# EAGLE design OPR_Main_v2 (EAGLE 7.6.0)
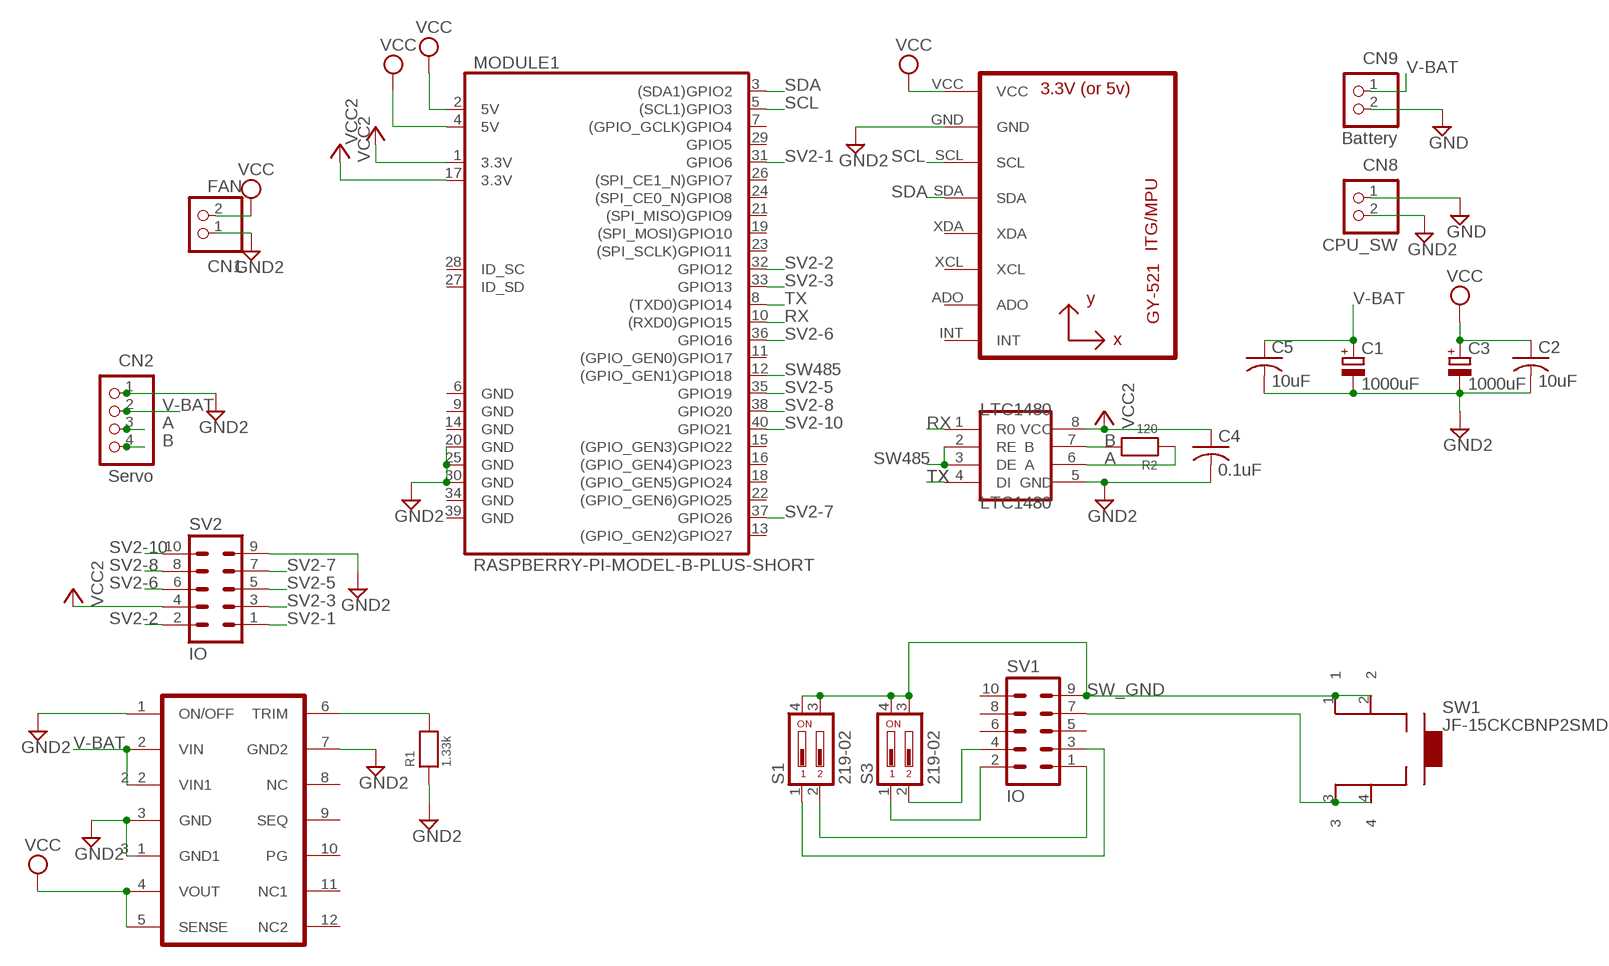
[diagram p0: schematic, sheet 1]

## Parts
C1  1000uF  CPOL-EUE5-10.5  [E5-10,5]
C2  10uF  C-USC3225  [C3225]
C3  1000uF  CPOL-EUE5-10.5  [E5-10,5]
C4  0.1uF  C-USC2012  [C2012]
C5  10uF  C-USC3225  [C3225]
CN1  FAN  B2B-XH-A  [B2B-XH-A]
CN2  Servo  S4B-XH-A  [S4B-XH-A]
CN8  CPU_SW  B2P-VH  [B2P-VH]
CN9  Battery  B2P-VH  [B2P-VH]
LTC1480  LTC1480  [SOIC-8]
MODULE1  RASPBERRY-PI-MODEL-B-PLUS-SHORT  [RASPBERRY-PI-MODEL-B-PLUS-SHORT]
R1  1.33k  RESISTOR0805_NOTHERMALS  [0805_NOTHERMALS]
R2  120  RESISTOR0805_NOTHERMALS  [0805_NOTHERMALS]
S1  219-02  [CTS-219-02]
S3  219-02  [CTS-219-02]
SV1  IO  ML10  [ML10]
SV2  IO  ML10  [ML10]
SW1  JF-15CKCBNP2SMD  [JF-15CKCBNP2-SMD]
U1  GY-521MPU6050  [GY-521]
U$3  OKL-T/W-12N-C  OKL_T6_W12  [OKL_T6_W12]

## Nets
A: CN2.3 LTC1480.6(A) R2.1
B: CN2.4 LTC1480.7(B) R2.2
GND [Supply]: CN8.1 CN9.2
GND2 [Supply]: C1.- C2.2 C3.- C4.2 C5.2 CN1.1 CN2.1 CN8.2 LTC1480.5(GND) MODULE1.20(GND) MODULE1.25(GND) MODULE1.30(GND) R1.1 SV2.9 U1.GND U$3.1(ON/OFF) U$3.3(GND) U$3.3_1(GND1) U$3.7(GND2)
N$1: R1.2 U$3.6(TRIM)
N$3: S3.2 SV1.4
N$5: SV1.7 SW1.3 SW1.4
N$6: S3.1 SV1.2
N$7: S1.2 SV1.1
N$8: S1.1 SV1.3
RX: LTC1480.1(R0) MODULE1.10((RXD0)GPIO15)
SCL [i2c]: MODULE1.5((SCL1)GPIO3) U1.SCL
SDA [i2c]: MODULE1.3((SDA1)GPIO2) U1.SDA
SV2-1: MODULE1.31(GPIO6) SV2.1
SV2-2: MODULE1.32(GPIO12) SV2.2
SV2-3: MODULE1.33(GPIO13) SV2.3
SV2-5: MODULE1.35(GPIO19) SV2.5
SV2-6: MODULE1.36(GPIO16) SV2.6
SV2-7: MODULE1.37(GPIO26) SV2.7
SV2-8: MODULE1.38(GPIO20) SV2.8
SV2-10: MODULE1.40(GPIO21) SV2.10
SW485: LTC1480.2(RE) LTC1480.3(DE) MODULE1.12((GPIO_GEN1)GPIO18)
SW_GND [Supply]: S1.3 S1.4 S3.3 S3.4 SV1.9 SW1.1 SW1.2
TX: LTC1480.4(DI) MODULE1.8((TXD0)GPIO14)
V-BAT [Supply]: C1.+ C5.1 CN2.2 CN9.1 U$3.2(VIN) U$3.2_2(VIN1)
VCC [Supply]: C2.1 C3.+ CN1.2 MODULE1.2(5V) MODULE1.4(5V) U1.VCC U$3.4(VOUT) U$3.5(SENSE)
VCC2 [Supply]: C4.1 LTC1480.8(VCC) MODULE1.1(3.3V) MODULE1.17(3.3V) SV2.4
Unconnected: MODULE1.6(GND) MODULE1.7((GPIO_GCLK)GPIO4) MODULE1.9(GND) MODULE1.11((GPIO_GEN0)GPIO17) MODULE1.13((GPIO_GEN2)GPIO27) MODULE1.14(GND) MODULE1.15((GPIO_GEN3)GPIO22) MODULE1.16((GPIO_GEN4)GPIO23) MODULE1.18((GPIO_GEN5)GPIO24) MODULE1.19((SPI_MOSI)GPIO10) MODULE1.21((SPI_MISO)GPIO9) MODULE1.22((GPIO_GEN6)GPIO25) MODULE1.23((SPI_SCLK)GPIO11) MODULE1.24((SPI_CE0_N)GPIO8) MODULE1.26((SPI_CE1_N)GPIO7) MODULE1.27(ID_SD) MODULE1.28(ID_SC) MODULE1.29(GPIO5) MODULE1.34(GND) MODULE1.39(GND) SV1.5 SV1.6 SV1.8 SV1.10 U1.ADO U1.INT U1.XCL U1.XDA U$3.8(NC) U$3.9(SEQ) U$3.10(PG) U$3.11(NC1) U$3.12(NC2)

## Library data of the parts
C1 C3 = resistor:CPOL-EU: POLARIZED CAPACITOR, European symbol
C2 C5 = adafruit:C-US: CAPACITOR, American symbol
C4 = rcl:C-US: CAPACITOR, American symbol
CN1 = jst-xh:B2B-XH-A: Wire-to-Board 2.5mm pitch top mount connector Source: http://www.jst-mfg.com/product/pdf/jpn/XH.pdf http://www.jst-mfg.com/product/detail.php?series=277
CN2 = jst-xh:S4B-XH-A: Wire-to-Board 2.5mm pitch side mount connector Source: http://www.jst-mfg.com/product/pdf/jpn/XH.pdf http://www.jst-mfg.com/product/detail.php?series=277
CN8 CN9 = jst-vh:B2P-VH: Wire-to-Board 3.96mm pitch top mount connector Source: http://www.jst-mfg.com/product/pdf/jpn/VH.pdf http://www.jst-mfg.com/product/detail.php?series=262
LTC1480 = Mylib:LTC1480
MODULE1 = raspberry-pi:RASPBERRY-PI-MODEL-B-PLUS: Raspberry Pi Model B Plus
R1 R2 = microbuilder:RESISTOR: Resistors 0402 - 0402 Surface Mount Package 22 Ohm 1% 1/16W [Digikey: 311-22.0LRTR-ND] 33 Ohm 5% 1/16W 1.0K 5% 1/16W 1.5K 5% 1/16W 2.0K 1% 1/16W 10.0K 1% 1/16W [Digikey: 311-10.0KLRTR-ND] 10.0K 5% 1/16W [Digikey: RMCF0402JT10K0TR-ND] 12.1K 1% 1/16W [Digikey: 311-22.0LRTR-ND] 100.0K 5% 1/16W 0603 - 0603 Surface Mount Package 0 Ohm 1/10 Watt 1% Resistor 15 Ohm 1/10 Watt 1% Resistor 33 Ohm 1/10 Watt 1% Resistor 49.9 Ohm 1/10 Watt 1% Resistor 100 Ohm 1/10 Watt 1% Resistor 150 Ohm 1/10 Watt 1% Resistor 240 Ohm 1/10 Watt 1% Resistor 390 Ohm 1/10 Watt 1% Resistor 560 Ohm 1/10 Watt 1% Resistor 680 Ohm 1/10 Watt 1% Resistor 750 Ohm 1/10 Watt 1% Resistor 1.0K Ohm 1/10 Watt 1% Resistor 1.5K Ohm 1/10 Watt 1% Resistor 2.0K Ohm 1/10 Watt 1% Resistor 2.2K Ohm 1/10 Watt 1% Resistor 3.3K Ohm 1/10 Watt 1% Resistor 4.7K Ohm 1/10 Watt 1% Resistor 10.0K Ohm 1/10 Watt 1% Resistor 12.0K Ohm 1/10 Watt 1% Resistor 12.1K Ohm 1/10 Watt 1% Resistor 20.0K Ohm 1/10 Watt 1% Resistor 33.0K Ohm 1/10 Watt 1% Resistor 100.0K Ohm 1/10 Watt 1% Resistor 0805 - 0805 Surface Mount Package 0 Ohm 1/8 Watt 1% Resistor 33 Ohm 1/8 Watt 1% Resistor 100 Ohm 1/8 Watt 1% Resistor 150 Ohm 1/8 Watt 1% Resistor 200 Ohm 1/8 Watt 1% Resistor 240 Ohm 1/8 Watt 1% Resistor 330 Ohm 1/8 Watt 1% Resistor 390 Ohm 1/8 Watt 1% Resistor 470 Ohm 1/8 Watt 1% Resistor 1.0K Ohm 1/8 Watt 1% Resistor 1.5K Ohm 1/8 Watt 1% Resistor 2.0K Ohm 1/8 Watt 1% Resistor 4.7K Ohm 1/8 Watt 1% Resistor 5.1K Ohm 1/8 Watt 1% Resistor 5.6K Ohm 1/8 Watt 1% Resistor 10.0K Ohm 1/8 Watt 1% Resistor 22.0K Ohm 1/8 Watt 1% Resistor 33.0K Ohm 1/8 Watt 1% Resistor 100K Ohm 1/8 Watt 1% Resistor 1206 - 1206 Surface Mount Package 2012 - 2010 Surface Mount Package 0.11 Ohm 1/2 Watt 1% Resistor - Digikey: RHM.11UCT-ND
S1 S3 = switch-dil:219-02*: Surface Mount DIP Switch Series 219 SMT CTS Electronic Components Sourc: www.ctscorp.com; OC_FARNELL: unknown; OC_NEWARK: unknown
SV1 SV2 = con-ml:ML10: HARTING; OC_FARNELL: unknown; OC_NEWARK: unknown
SW1 = nkk-JF15CKCBNP2:JF-15CKCBNP2: JF-15CKCBNP2
U1 = Mylib:GY-521
U$3 = Mylib:OKL_T6_W12

## Net classes
0 default: width 0.406 mm, clearance 0.127 mm
1 Supply: width 1.524 mm, clearance 0.127 mm
2 i2c: width 0.813 mm, clearance 0.127 mm

## Board
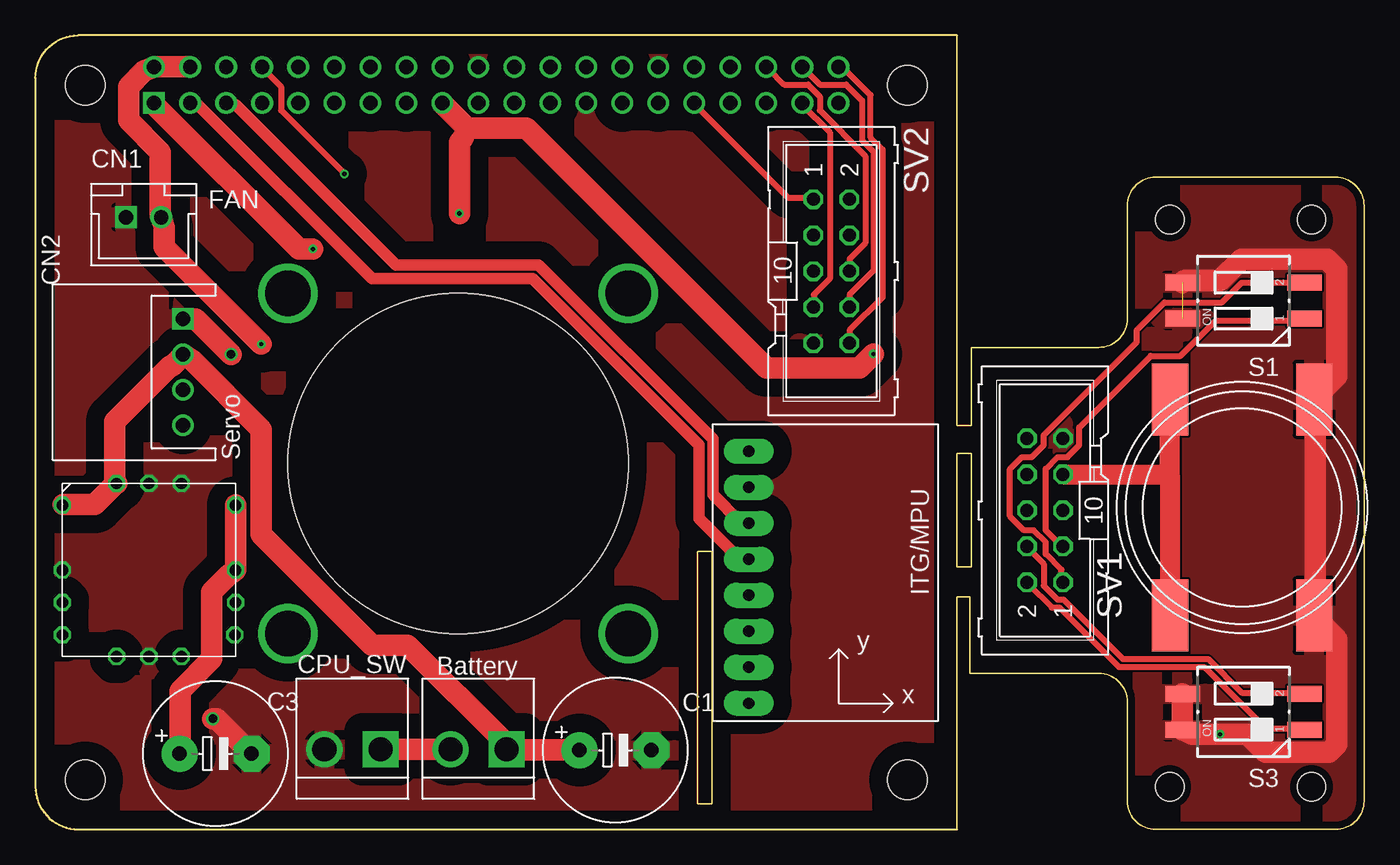
[diagram p1: board, top side]
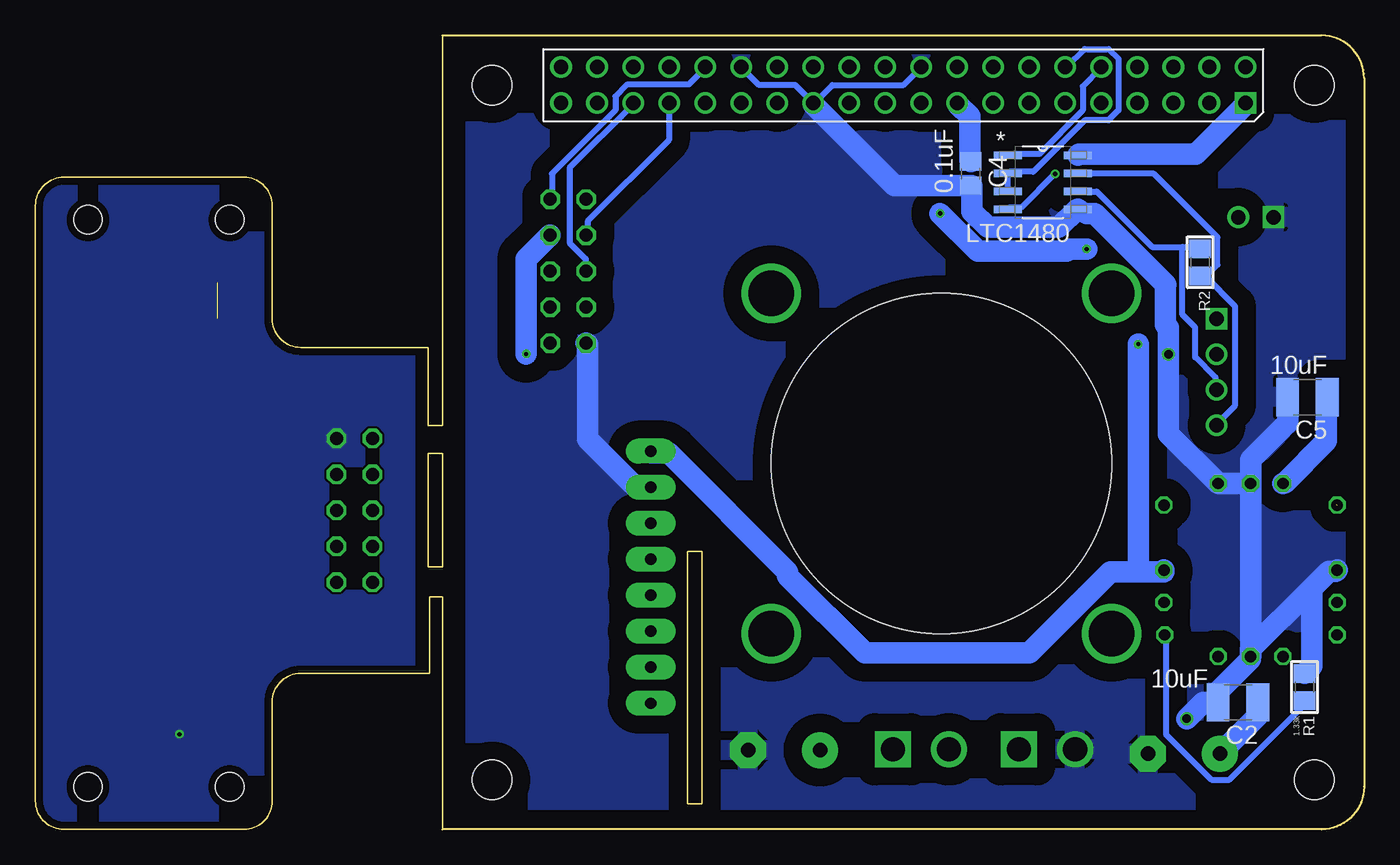
[diagram p2: board, bottom side, seen from below]

Size 93.7 x 56 mm. Coordinates in mm from the lower left corner, seen from the top.
Outline: 65,56 65,28.5 66,28.5 66,34 75,34 arc90 77,36 77,44 arc-90 79,46 91.7,46 arc-90 93.7,44 93.7,2 arc-90 91.7,0 79,0 arc-90 77,2 77,9 arc90 75,11 65.9,11 65.9,16.4 65,16.4 65,0
Outline: 46.7,19.6 47.7,19.6 47.7,1.8 46.7,1.8 46.7,19.6
Outline: 65,18.5 66,18.5 66,26.5 65,26.5 65,18.5
Copper layers (1*16): Top 0.035mm / dielectric 1.53mm / Bottom 0.035mm
Design rules "pban_5mil-l2 *": minimum track width 5mil, minimum drill 0.3mm, track to track 6mil, track to pad 0.229mm, pad to pad 6mil, via to via 6mil, smd to smd 6mil, copper to edge 0.5mm, drill to drill 0.5mm, minimum pad ring 0.15mm, minimum via ring 0.15mm, stop-mask expansion 4mil, vias tented up to drill 0.35mm, thermal gap 10mil
Holes 24 mm at 29.81,25.8
Holes 2 mm at 80,43 80,3 90,43 90,3

### Footprints (pad centres in the part's own frame; a part is rotated, then mirrored left to right if it is on the bottom)
E5-10,5 = drill 1.016 pad 2.54: + -2.54,0 | drill 1.016 pad 2.54 octagon: - 2.54,0
C3225 = smd 1.6 x 2.7: 1 -1.4,0; 2 1.4,0
C2012 = smd 1.3 x 1.5: 1 -0.85,0; 2 0.85,0
B2B-XH-A = drill 1.016 square: 1 -1.25,0 | drill 1.016: 2 1.25,0
S4B-XH-A = drill 1.016 square: 1 3.75,0 | drill 1.016: 2 1.25,0; 3 -1.25,0; 4 -3.75,0
B2P-VH = drill 1.7 square: 1 -1.98,0 | drill 1.7: 2 1.98,0
SOIC-8 = smd 1.981 x 0.533: 1 -2.464,1.905; 2 -2.464,0.635; 3 -2.464,-0.635; 4 -2.464,-1.905; 5 2.464,-1.905; 6 2.464,-0.635; 7 2.464,0.635; 8 2.464,1.905
RASPBERRY-PI-MODEL-B-PLUS-SHORT = drill 1.016 square: 1 8.37,51.23 | drill 1.016: 2 8.37,53.77; 3 10.91,51.23; 4 10.91,53.77; 5 13.45,51.23; 6 13.45,53.77; 7 15.99,51.23; 8 15.99,53.77; 9 18.53,51.23; 10 18.53,53.77; 11 21.07,51.23; 12 21.07,53.77; 13 23.61,51.23; 14 23.61,53.77; 15 26.15,51.23; 16 26.15,53.77; 17 28.69,51.23; 18 28.69,53.77; 19 31.23,51.23; 20 31.23,53.77; 21 33.77,51.23; 22 33.77,53.77; 23 36.31,51.23; 24 36.31,53.77; 25 38.85,51.23; 26 38.85,53.77; 27 41.39,51.23; 28 41.39,53.77; 29 43.93,51.23; 30 43.93,53.77; 31 46.47,51.23; 32 46.47,53.77; 33 49.01,51.23; 34 49.01,53.77; 35 51.55,51.23; 36 51.55,53.77; 37 54.09,51.23; 38 54.09,53.77; 39 56.63,51.23; 40 56.63,53.77 | hole 2.8: 3.5,52.5; 3.5,3.5; 61.5,3.5; 61.5,52.5
0805_NOTHERMALS = smd 1.3 x 1.5: 1 -0.95,0; 2 0.95,0
CTS-219-02 = smd 1.13 x 2.44: 1 -1.27,-4.3; 2 1.27,-4.3; 3 1.27,4.3; 4 -1.27,4.3
ML10 = drill 0.914 octagon: 1 -5.08,-1.27; 2 -5.08,1.27; 3 -2.54,-1.27; 4 -2.54,1.27; 5 0,-1.27; 6 0,1.27; 7 2.54,-1.27; 8 2.54,1.27; 9 5.08,-1.27; 10 5.08,1.27
JF-15CKCBNP2-SMD = smd 2.54 x 5.08: 1 5.08,7.62; 2 5.08,-7.62; 3 -5.08,7.62; 4 -5.08,-7.62
GY-521 = drill 0.8 pad 1.778 long: ADO -8.89,-6.35; GND -8.89,6.35; INT -8.89,-8.89; SCL -8.89,3.81; SDA -8.89,1.27; VCC -8.89,8.89; XCL -8.89,-3.81; XDA -8.89,-1.27
OKL_T6_W12 = drill 0.8 octagon: 1 0,6.1; 2 0,10.68; 2_2 3.81,12.2; 3 6.1,12.2; 3_1 8.39,12.2; 4 12.2,10.68; 5 12.2,6.1; 6 12.16,1.52; 7 6.1,0; 8 3.81,0; 9 0,1.52; 10 0,3.81; 11 12.2,3.81; 12 8.39,0

### Placement (x,y rotation side)
C1  40.9,5.59 0 top
C2  8.89,8.95 180 bottom
C3  12.7,5.33 0 top
C4  27.74,46.25 270 bottom
C5  3.99,30.48 180 bottom
CN1  7.62,43.18 0 top
CN2  10.41,32.26 90 top
CN8  22.36,5.64 180 top
CN9  31.25,5.64 180 top
LTC1480  22.66,45.64 0 bottom
MODULE1  0,0 0 top
R1  4.19,10.03 270 bottom
R2  11.56,40.01 270 bottom
S1  85.2,37.3 90 top
S3  85.2,8.3 90 top
SV1  71.2,22.5 90 top
SV2  56.13,39.37 270 top
SW1  85.1,22.7 0 top
U1  59.2,17.78 0 top
U$3  1.91,12.19 0 top

### Tracks (layer width: path | path; a pad name or v marks a point on that pad's centre or on a via)
A
  Bottom 0.406: 12.8,41.07 14.95,41.07 18.86,44.98 20.12,44.98 LTC1480.6 | 12.8,41.07 11.6,41.07 R2.1 | CN2.3 10.48,31.01 10.48,31.88 11.9,33.3 11.9,35.4 12.8,36.3 12.8,41.07
B
  Bottom 0.406: CN2.4 10.34,28.64 9.08,29.9 9.08,36.88 11.18,38.98 11.46,38.98 R2.2 11.04,39.12 10.34,39.81 10.34,41.77 14.81,46.24 20.12,46.24 LTC1480.7
GND
  Top 1.524: CN8.1 CN9.2
GND2  (via drill 0.6)
  Top 1.524: CN2.1 11.29,36.01 v13.8,33.5 | v12.5,7.8 12.77,7.8 C3.-
  Bottom 0.406: MODULE1.20 32.5,52.5 37.5,52.5 38.77,51.23 MODULE1.25 38.85,51.25 40.1,52.5 42.66,52.5 MODULE1.30
  Bottom 1.524: 20.26,43.73 21.51,42.47 26.54,42.47 27.66,43.59 27.66,45.4 C4.2 28.5,45.4 33.11,45.4 38.84,51.13 MODULE1.25 | 20.26,43.73 LTC1480.5 | SV2.9 54.76,34.23 54.76,27.52 51.41,24.17 50.43,24.17 U1.GND | 20.26,43.73 19.56,43.45 19,43.45 13.97,38.42 14,38.39 14,35.6 13.8,35.4 v13.8,33.5 13.8,27.9 U$3.3_1 U$3.3 | C5.2 5.39,28.71 8,26.1 U$3.3 | U$3.7 8.01,11.99 10.3,9.7 10.3,8.96 C2.2 11.35,8.95 v12.5,7.8 | U$3.3 U$3.7 | R1.1 4.19,11.01 3.7,11.5 3.7,17 | 3.7,17 2.5,18.2 2,18.2 U$3.1 | U$3.7 8.01,12.7 3.7,17
  pour Bottom (isolate 1.27, rank 2): -1.61,56.97 62.68,57.04 62.68,-1.89 -1.61,-2.36
  pour Top (isolate 1.27, rank 2): 62.67,57.08 62.67,-0.02 -0.09,-0.3 -0.23,56.89
N$1
  Bottom 0.406: R1.2 4.19,8.8 9.5,3.49 10.76,3.49 13.97,6.71 13.97,13.69 U$3.6
N$3
  Top 0.406: S3.2 89.41,9.64 85.08,9.64 82.7,12.01 76.69,12.01 72.5,16.2 72.08,16.2 71.11,17.18 71.11,18.72 69.99,19.84 SV1.4
N$5
  Top 0.406: 79.91,30.32 SW1.3 | 79.91,15.09 SW1.4
  Top 1.422: SV1.7 79.96,25.04 80,25 | 80,25 80,30.3 SW1.3 | 80,25 80,15.1 SW1.4
N$6
  Top 0.406: S3.1 89.41,7.12 86.75,7.12 82.42,11.46 76.42,11.46 72.22,15.65 71.67,15.65 69.99,17.32 SV1.2
N$7
  Top 0.406: S1.2 89.41,38.56 85.08,38.56 83.68,37.16 79.63,37.16 77.67,35.2 77.67,34.37 71.11,27.8 71.11,27.1 70.27,26.26 69.57,26.26 68.73,25.43 68.73,22.07 69.71,21.09 70.41,21.09 71.25,20.26 71.25,19.42 72.36,18.3 72.36,17.46 SV1.1
N$8
  Top 0.406: S1.1 89.41,35.9 83.26,35.9 80.75,33.39 78.65,33.39 73.62,28.36 73.62,27.1 72.78,26.26 72.08,26.26 71.25,25.43 71.25,21.09 72.36,19.98 SV1.3
RX
  Bottom 0.406: LTC1480.1 25.01,47.64 22.91,47.64 19.84,50.71 19.84,52.39 18.58,53.65 MODULE1.10
S$6  (via drill 3.2)
  other vias: 17.81,37.81
S$7  (via drill 3.2)
  other vias: 17.81,13.81
S$8  (via drill 3.2)
  other vias: 41.81,13.81
S$9  (via drill 3.2)
  other vias: 41.81,37.81
SCL
  Top 0.813: MODULE1.5 13.55,51.13 14.11,51.13 25.43,39.81 35.48,39.81 47.78,27.52 47.78,23.61 49.73,21.65 50.29,21.65 U1.SCL
SDA
  Top 0.813: MODULE1.3 11.04,51.13 11.46,51.13 23.75,38.84 35.06,38.84 46.8,27.1 46.8,21.93 49.59,19.14 50.29,19.14 U1.SDA
SV2-1
  Top 0.406: SV2.1 54.76,44.56 53.09,44.56 46.52,51.13 MODULE1.31
SV2-2
  Bottom 0.406: SV2.2 57.28,44.56 57.28,46.24 52.81,50.71 52.81,51.69 51.97,52.53 47.64,52.53 46.52,53.65 MODULE1.32
SV2-3
  Bottom 0.406: SV2.3 54.76,41.91 54.76,42.89 49.03,48.62 49.03,51.13 MODULE1.33
SV2-5
  Bottom 0.406: SV2.5 54.9,39.4 54.9,40.23 56.02,41.35 56.02,46.66 51.55,51.13 MODULE1.35
SV2-6
  Top 0.406: SV2.6 57.42,39.4 57.42,40.23 58.53,41.35 58.53,47.5 55.32,50.71 55.32,51.69 54.48,52.53 52.81,52.53 51.69,53.65 MODULE1.36
SV2-7
  Top 0.406: SV2.7 54.9,36.88 54.9,37.72 56.02,38.84 56.02,49.17 54.06,51.13 MODULE1.37
SV2-8
  Top 0.406: SV2.8 57.42,36.88 57.42,37.72 59.1,39.4 59.1,47.8 58.3,48.6 58.3,51.4 57.17,52.53 55.32,52.53 54.2,53.65 MODULE1.38
SV2-10
  Top 0.406: SV2.10 57.42,34.37 57.42,35.2 59.75,37.54 59.75,47.95 58.9,48.8 58.9,51.8 56.93,53.77 MODULE1.40
SW485
  Bottom 0.406: LTC1480.3 25.15,45.12 25.15,46.24 LTC1480.2 25.01,46.38 23.33,46.38 19.7,50.01 18.02,50.01 17.32,50.71 17.32,54.34 18.02,55.04 19.7,55.04 20.95,53.78 MODULE1.12
SW_GND  (via drill 0.3)  (1 unrouted)
  Top 1.524: S3.3 80.89,9.5 80.89,7.12 S3.4 81.58,6.71 v83.54,6.71 85.5,6.71 86.75,5.45 91.22,5.45 91.78,6.01 91.78,13.41 90.25,14.95 SW1.2 90.25,15.79 90.25,29.62 SW1.1 90.25,30.45 91.78,31.99 91.78,39.53 91.08,40.23 85.08,40.23 83.54,38.7 81.03,38.7 S1.3
  pour Bottom: 94,46 94,0 77,0 77,11 67.6,11 67.6,34 77,34 77,46
  pour Top: 67.6,33.9 75.3,34 76.9,35.4 76.9,45.6 76.8,45.7 92.7,45.7 93.7,44.7 93.7,1.3 92.5,0.1 78.6,0.1 77.3,1.4 77.3,9.4 75.7,11 67.6,10.9
TX  (via drill 0.3)
  Top 0.406: v21.79,46.24 17.32,50.71 17.32,52.39 16.07,53.65 MODULE1.8
  Bottom 0.406: v21.79,46.24 24.17,43.87 25.01,43.87 LTC1480.4
V-BAT  (1 unrouted)
  Top 1.524: 1.96,22.91 4.19,22.91 5.59,24.31 | 5.59,24.31 U$3.2_2 | 5.59,24.31 5.59,28.78 9.5,32.69 9.64,32.69 10.34,33.39 CN2.2 11.04,33.11 15.93,28.22 15.93,20.82 23.75,12.99 26.26,12.99 33.23,6.03 33.23,5.44 CN9.1 33.23,5.33 33.5,5.6 C1.+
  Bottom 1.524: C5.1 2.65,30.45 2.65,27.38 5.59,24.45 U$3.2_2
VCC  (via drill 0.3)
  Top 1.524: MODULE1.4 10.9,53.78 8.38,53.78 MODULE1.2 7.68,53.51 6.57,52.39 6.57,50.01 8.8,47.78 8.8,43.31 CN1.2 9.08,42.47 9.08,41.07 v15.93,34.23 | U$3.5 14.11,22.77 U$3.4 | U$3.5 | C3.+ 10.2,5.45 10.2,9.78 12.43,12.01 12.43,16.76 13.55,17.88 U$3.5
  Bottom 1.524: 15.93,18.16 14.11,18.16 U$3.5 | 15.93,18.16 17.88,18.16 23.61,12.43 35.2,12.43 40.65,17.88 40.65,18.16 49.03,26.54 50.29,26.54 U1.VCC | 15.93,18.16 v15.93,34.23 | C2.1 7.49,8 C3.+
VCC2  (via drill 0.3)
  Top 1.524: v59.09,33.53 58.12,32.55 51.55,32.55 34.65,49.45 30.45,49.45 | 30.45,49.45 28.78,51.13 MODULE1.17 | v19.56,40.93 18.58,40.93 8.38,51.13 MODULE1.1 | v29.9,43.45 29.9,48.48 30.18,48.76 30.45,49.45
  Bottom 1.524: LTC1480.8 20.12,47.64 11.87,47.64 8.38,51.13 MODULE1.1 | C4.1 27.8,47.22 27.8,50.29 28.64,51.13 MODULE1.17 | v59.09,33.53 59.09,40.23 57.42,41.91 SV2.4 | v19.56,40.93 20.82,40.93 20.95,40.79 27.24,40.79 v29.9,43.45